# Altium schematic sheet Battery_eFuse.SchDoc
size 297 x 209 mm; SheetNumber: 4; SheetTotal: 9
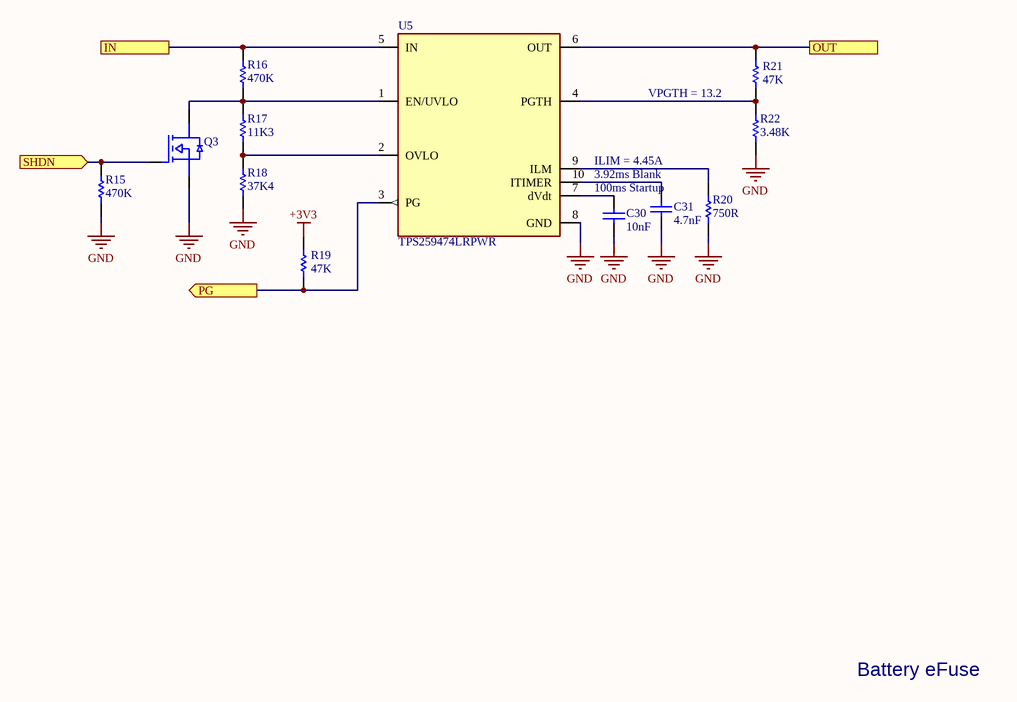
[diagram p0: Battery_eFuse.SchDoc]

## Parts
C30  Capacitance: 10nF  [CAPC0603X060]  (hidden comment: CL10B103KB8NNNC)
C31  Capacitance: 4.7nF  [CAPC0603X040]  (hidden comment: C0603C472K4RECAUTO)
Q3  T2N7002AK,LM  [SOT23-3 MOSFET]  (value not drawn)
R15  Resistance: 470K  [RESC0603]  (hidden comment: RMCF0603FT470K)
R16  Resistance: 470K  [RESC0603]  (hidden comment: RMCF0603FT470K)
R17  Resistance: 11K3  [RESC0603]  (hidden comment: RMCF0603FT11K3)
R18  Resistance: 37K4  [RESC0603]  (hidden comment: RMCF0603FT37K4)
R19  Resistance: 47K  [RESC0603]  (hidden comment: RMCF0603FT47K0)
R20  Resistance: 750R  [RESC0603]  (hidden comment: RMCF0603FT750R)
R21  Resistance: 47K  [RESC0603]  (hidden comment: RMCF0603FT47K0)
R22  Resistance: 3.48K  [RESC0603]  (hidden comment: RMCF0603FT3K48)
U5  TPS259474LRPWR  [VFQFN-10]

## Ports
IN (see Power_Path[4B]), OUT (see Power_Path[4B], Umbilical_eFuse[5B]), PG (out, see Power_Path[4B]), SHDN (in, see Power_Path[4B])

## Nets
+3V3: R19.2
GND: C30.1 C31.1 Q3.S R15.1 R18.1 R20.1 R22.1 U5.8(GND)
IN: R16.2 U5.5(IN) ; port IN
OUT: R21.2 U5.6(OUT) ; port OUT
PG: R19.1 U5.3(PG) ; port PG
SHDN: Q3.G R15.2 ; port SHDN
NetC30_2: C30.2 U5.7(dVdt)
NetC31_2: C31.2 U5.10(ITIMER)
NetQ3_D: Q3.D R16.1 R17.2 U5.1(EN/UVLO)
NetR17_1: R17.1 R18.2 U5.2(OVLO)
NetR20_2: R20.2 U5.9(ILM)
NetR21_1: R21.1 R22.2 U5.4(PGTH)

## Notes on the sheet
- VPGTH = 13.2
- ILIM = 4.45A
- 3.92ms Blank
- 100ms Startup
- Battery eFuse
- Size:
- Title:
- A4
- Project:
- Rev:
- Date:
- Drawn By:
- Sheet:
- of

## Library data of the parts
C30 = CL10B103KB8NNNC: 10nF ±10% 50V Ceramic Capacitor X7R 0603 (1608 Metric); Part Number: CL10B103KB8NNNC; Distributor Part Number: 1276-1009-1-ND; Tolerance: 10%; Case Code: 0603; Distributor: Digikey; Voltage Rating: 50V
C31 = C0603C472K4RECAUTO: 4.7nF ±10% 16V Ceramic Capacitor X7R 0603 (1608 Metric); Part Number: C0603C472K4RECAUTO; Tolerance: 10%; Distributor Part number: 399-17879-1-ND; Case Code: 0603; Distributor: Digikey; Dielectric: X7R; Voltage Rating: 16V
Q3 = T2N7002AK,LM: N-Channel 60 V 200mA (Ta) 320mW (Ta) Surface Mount SOT-23-3; Drain to Source Voltage: 60V; Rds On (Max) @ Id, Vgs: 3.9ohm; Vgs(th) (Max) @ Id: 2.1V @ 250µA; (Id) @ 25°C: 200mA; Vgs (Max): *; Power Dissipation (Max): 320mW (Ta); Operating Temperature: -55C - 150C; Part Number: T2N7002AK,LM; Distributor Part Number: T2N7002AKLMCT-ND; Distributor: Digikey
R15 R16 = RMCF0603FT470K: 470 kOhms ±1% 0.1W, 1/10W Chip Resistor 0603 (1608 Metric) Automotive AEC-Q200 Thick Film; Part Number: RMCF0603FT470K; Tolerance: 1%; Distributor: Digikey; Distributor Part Number: RMCF0603FT470KCT-ND; Case Code: 0603
R17 = RMCF0603FT11K3: 11.3 kOhms ±1% 0.1W, 1/10W Chip Resistor 0603 (1608 Metric) Automotive AEC-Q200 Thick Film; Part Number: RMCF0603FT11K3; Distributor: Digikey; Distributor Part Number: RMCF0603FT11K3CT-ND; Case Code: 0603; Tolerance: 1%
R18 = RMCF0603FT37K4: 37.4 kOhms ±1% 0.1W, 1/10W Chip Resistor 0603 (1608 Metric) Automotive AEC-Q200 Thick Film; Part Number: RMCF0603FT37K4; Tolerance: 1%; Distributor: Digikey; Distributor Part Number: RMCF0603FT37K4CT-ND; Case Code: 0603
R19 R21 = RMCF0603FT47K0: 47 kOhms ±1% 0.1W, 1/10W Chip Resistor 0603 (1608 Metric) Automotive AEC-Q200 Thick Film; Part Number: RMCF0603FT47K0; Tolerance: 1%; Distributor Part Number: RMCF0603FT47K0CT-ND; Distributor: Digikey; Case Code: 0603
R20 = RMCF0603FT750R: 750 Ohms ±1% 0.1W, 1/10W Chip Resistor 0603 (1608 Metric) Automotive AEC-Q200 Thick Film; Part Number: RMCF0603FT750R; Tolerance: 1%; Distributor: Digikey; Distributor Part Number: RMCF0603FT750RCT-ND; Case Code: 0603
R22 = RMCF0603FT3K48: 3.48 kOhms ±1% 0.1W, 1/10W Chip Resistor 0603 (1608 Metric) Automotive AEC-Q200 Thick Film; Part Number: RMCF0603FT3K48; Tolerance: 1%; Distributor: Digikey; Distributor Part Number: RMCF0603FT3K48CT-ND; Case Code: 0603
U5 = TPS259474LRPWR: eFuse 5.5A, 2.7V~23V, 28mOhm, Reverse Current Blocking with Input Reverse Polarity Protection; Part Number: TPS259474LRPWR; Distributor: Digikey; Distributor Part Number: 296-TPS259474LRPWRCT-ND; Operating Temperature: -40°C ~ 125°C; Output Current: 5.5A; Voltage Input: 2.7V~23V